# EAGLE schematic bln-002 (EAGLE 9.6.2)
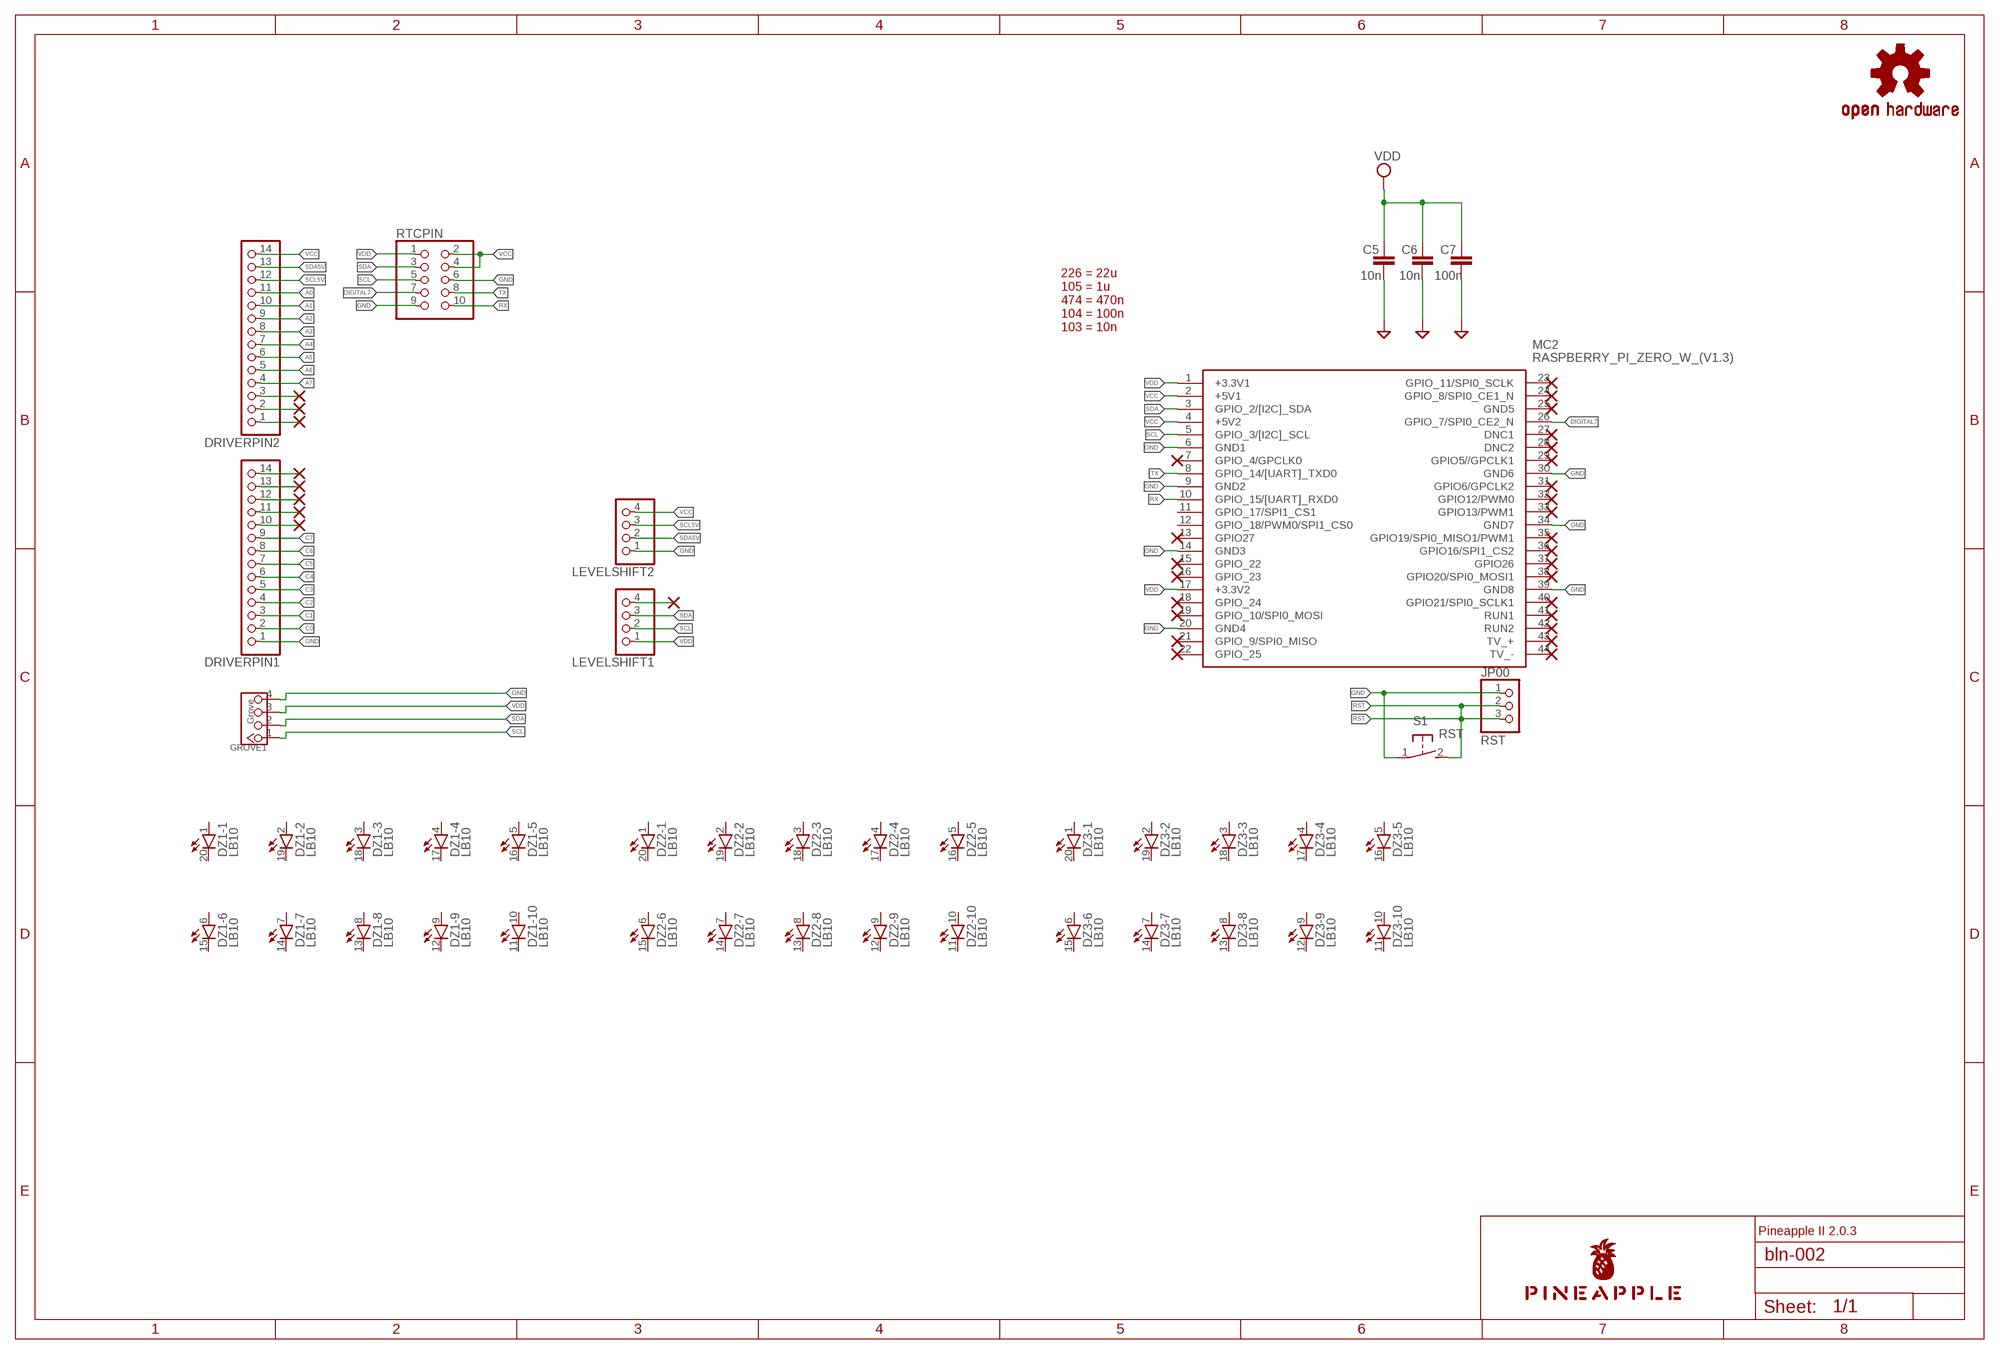
[diagram p0: schematic, sheet 1]

## Parts
C5  10n  C-EU025-024X044  [C025-024X044]
C6  10n  C-EU025-024X044  [C025-024X044]
C7  100n  C-EU025-024X044  [C025-024X044]
DRIVERPIN1  PINHD-1X14  [1X14]
DRIVERPIN2  PINHD-1X14  [1X14]
DZ1  LB10  [LB10]
DZ2  LB10  [LB10]
DZ3  LB10  [LB10]
GROVE1  Grove  TWIG-4P-2.0'90D'  [4P-2.0-90D]
JP00  RST  PINHD-1X3  [1X03]
LEVELSHIFT1  PINHD-1X4  [1X04]
LEVELSHIFT2  PINHD-1X4  [1X04]
LOGO1  OSHW-LOGOS-COPPER  [OSHW-LOGO-S_COPPER]
MC2  RASPBERRY_PI_ZERO_W_(V1.3)  [RASPBERRYPIZEROWV13]
RTCPIN  PINHD-2X5  [2X05]
S1  RST  31-XX  [B3F-31XX]
U$1  PINEAPPLE450_SILK  [PINEAPPLE450_SILK]

## Nets
A0: DRIVERPIN2.11
A1: DRIVERPIN2.10
A2: DRIVERPIN2.9
A3: DRIVERPIN2.8
A4: DRIVERPIN2.7
A5: DRIVERPIN2.6
A6: DRIVERPIN2.5
A7: DRIVERPIN2.4
C0: DRIVERPIN1.2
C1: DRIVERPIN1.3
C2: DRIVERPIN1.4
C3: DRIVERPIN1.5
C4: DRIVERPIN1.6
C5: DRIVERPIN1.7
C6: DRIVERPIN1.8
C7: DRIVERPIN1.9
DIGITAL7: MC2.26(GPIO_7/SPI0_CE2_N) RTCPIN.7
GND [gnd]: C5.2 C6.2 C7.2 DRIVERPIN1.1 GROVE1.4 JP00.1 LEVELSHIFT2.1 MC2.6(GND1) MC2.9(GND2) MC2.14(GND3) MC2.20(GND4) MC2.30(GND6) MC2.34(GND7) MC2.39(GND8) RTCPIN.6 RTCPIN.9 S1.1(P)
N$5: LEVELSHIFT1.4
N$9: DRIVERPIN1.10
N$10: DRIVERPIN1.11
N$11: DRIVERPIN1.12
N$12: DRIVERPIN1.13
N$13: DRIVERPIN1.14
N$14: DRIVERPIN2.1
N$15: DRIVERPIN2.2
N$16: DRIVERPIN2.3
RST: JP00.2 JP00.3 S1.2(S)
RX: MC2.10(GPIO_15/[UART]_RXD0) RTCPIN.10
SCL: GROVE1.1 LEVELSHIFT1.2 MC2.5(GPIO_3/[I2C]_SCL) RTCPIN.5
SCL5V: DRIVERPIN2.12 LEVELSHIFT2.3
SDA: GROVE1.2 LEVELSHIFT1.3 MC2.3(GPIO_2/[I2C]_SDA) RTCPIN.3
SDA5V: DRIVERPIN2.13 LEVELSHIFT2.2
TX: MC2.8(GPIO_14/[UART]_TXD0) RTCPIN.8
VCC [power]: DRIVERPIN2.14 LEVELSHIFT2.4 MC2.2(+5V1) MC2.4(+5V2) RTCPIN.2 RTCPIN.4
VDD [power]: C5.1 C6.1 C7.1 GROVE1.3 LEVELSHIFT1.1 MC2.1(+3.3V1) MC2.17(+3.3V2) RTCPIN.1
Unconnected: DZ1.1(-1:A) DZ1.2(-2:A) DZ1.3(-3:A) DZ1.4(-4:A) DZ1.5(-5:A) DZ1.6(-6:A) DZ1.7(-7:A) DZ1.8(-8:A) DZ1.9(-9:A) DZ1.10(-10:A) DZ1.11(-10:C) DZ1.12(-9:C) DZ1.13(-8:C) DZ1.14(-7:C) DZ1.15(-6:C) DZ1.16(-5:C) DZ1.17(-4:C) DZ1.18(-3:C) DZ1.19(-2:C) DZ1.20(-1:C) DZ2.1(-1:A) DZ2.2(-2:A) DZ2.3(-3:A) DZ2.4(-4:A) DZ2.5(-5:A) DZ2.6(-6:A) DZ2.7(-7:A) DZ2.8(-8:A) DZ2.9(-9:A) DZ2.10(-10:A) DZ2.11(-10:C) DZ2.12(-9:C) DZ2.13(-8:C) DZ2.14(-7:C) DZ2.15(-6:C) DZ2.16(-5:C) DZ2.17(-4:C) DZ2.18(-3:C) DZ2.19(-2:C) DZ2.20(-1:C) DZ3.1(-1:A) DZ3.2(-2:A) DZ3.3(-3:A) DZ3.4(-4:A) DZ3.5(-5:A) DZ3.6(-6:A) DZ3.7(-7:A) DZ3.8(-8:A) DZ3.9(-9:A) DZ3.10(-10:A) DZ3.11(-10:C) DZ3.12(-9:C) DZ3.13(-8:C) DZ3.14(-7:C) DZ3.15(-6:C) DZ3.16(-5:C) DZ3.17(-4:C) DZ3.18(-3:C) DZ3.19(-2:C) DZ3.20(-1:C) MC2.7(GPIO_4/GPCLK0) MC2.11(GPIO_17/SPI1_CS1) MC2.12(GPIO_18/PWM0/SPI1_CS0) MC2.13(GPIO27) MC2.15(GPIO_22) MC2.16(GPIO_23) MC2.18(GPIO_24) MC2.19(GPIO_10/SPI0_MOSI) MC2.21(GPIO_9/SPI0_MISO) MC2.22(GPIO_25) MC2.23(GPIO_11/SPI0_SCLK) MC2.24(GPIO_8/SPI0_CE1_N) MC2.25(GND5) MC2.27(DNC1) MC2.28(DNC2) MC2.29(GPIO5//GPCLK1) MC2.31(GPIO6/GPCLK2) MC2.32(GPIO12/PWM0) MC2.33(GPIO13/PWM1) MC2.35(GPIO19/SPI0_MISO1/PWM1) MC2.36(GPIO16/SPI1_CS2) MC2.37(GPIO26) MC2.38(GPIO20/SPI0_MOSI1) MC2.40(GPIO21/SPI0_SCLK1) MC2.41(RUN1) MC2.42(RUN2) MC2.43(TV_+) MC2.44(TV_-)

## Notes on the sheet
- 226 = 22u
  105 = 1u
  474 = 470n
  104 = 100n
  103 = 10n
- Pineapple II 2.0.3

## Library data of the parts
C5-C7 = resistor:C-EU: CAPACITOR, European symbol
DRIVERPIN1 DRIVERPIN2 = pinhead:PINHD-1X14: PIN HEADER
DZ1-DZ3 = led:LB10: LED BLOCK 10-LED bar graph, DIL, Siemens
GROVE1 = Connector:TWIG-4P-2.0
JP00 = pinhead:PINHD-1X3: PIN HEADER
LEVELSHIFT1 LEVELSHIFT2 = pinhead:PINHD-1X4: PIN HEADER
LOGO1 = SparkFun-Aesthetics:OSHW-LOGO: Open-Source Hardware (OSHW) Logo This logo indicates the piece of hardware it is found on incorporates a OSHW license and/or adheres to the definition of open source hardware found here: http://freedomdefined.org/OSHW
MC2 = Raspberry_Pi_Zero_W_(v1.3):RASPBERRY_PI_ZERO_W_(V1.3): Raspberry Pi Zero W (v1.3) Single-board Computers Source: Datasheet <https://cdn.sparkfun.com/assets/learn_tutorials/6/7/6/PiZero_1.pdf>; ARROW_PART_NUMBER: Raspberry Pi Zero W (v1.3); DESCRIPTION: Raspberry Pi Zero W (v1.3) Single-board Computers; HEIGHT: mm; MANUFACTURER_NAME: RASPBERRY-PI; MANUFACTURER_PART_NUMBER: Raspberry Pi Zero W (v1.3)
RTCPIN = pinhead:PINHD-2X5: PIN HEADER
S1 = switch-omron:31-XX: OMRON SWITCH; MPN: B3F-3100; OC_FARNELL: 959704; OC_NEWARK: 36M3582
U$1 = pineapple:PINEAPPLE450_SILK

## Net classes
0 default: width 0.152 mm, drill 0.152 mm, clearance 0.152 mm
1 gnd: width 0.305 mm, drill 0.152 mm, clearance 0.152 mm
2 power: width 0.508 mm, drill 0.152 mm, clearance 0.152 mm
3 analog: width 0.305 mm, drill 0.152 mm, clearance 0.152 mm
4 superpower: width 1.016 mm, drill 0.152 mm, clearance 0.152 mm